# EAGLE design analogControlBoardV1 (EAGLE 6.4)
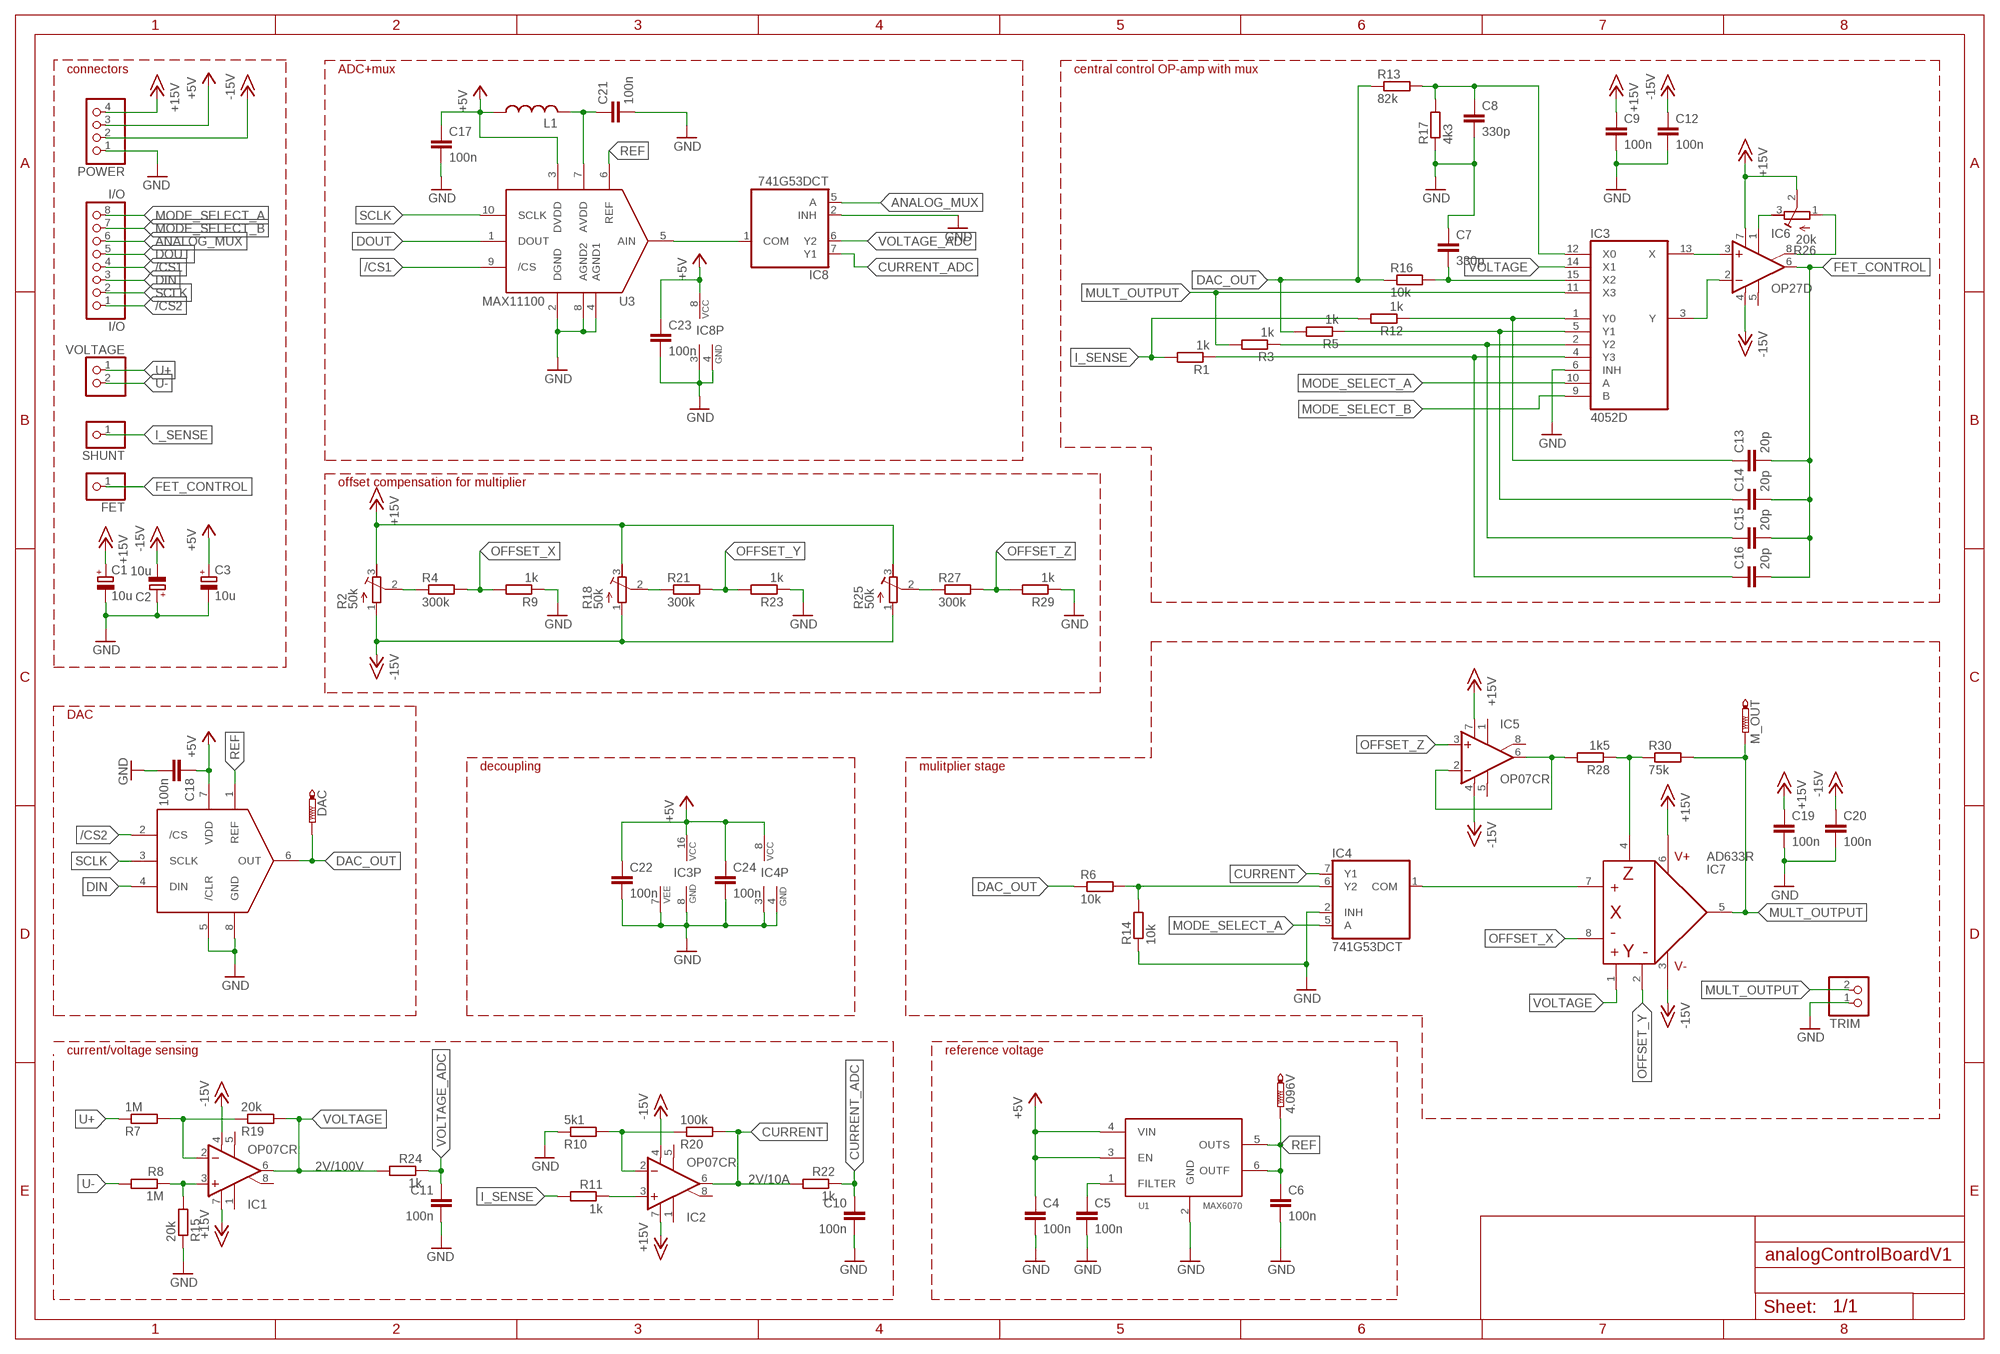
[diagram p0: schematic, sheet 1]

## Parts
4.096V  PTR1TP06R  [TP06R]
C1  10u  CPOL-EU153CLV-0505  [153CLV-0505]
C2  10u  CPOL-EU153CLV-0505  [153CLV-0505]
C3  10u  CPOL-EU153CLV-0505  [153CLV-0505]
C4  100n  C-EUC0603K  [C0603K]
C5  100n  C-EUC0603K  [C0603K]
C6  100n  C-EUC0603K  [C0603K]
C7  330p  C-EUC0603K  [C0603K]
C8  330p  C-EUC0603K  [C0603K]
C9  100n  C-EUC0603K  [C0603K]
C10  100n  C-EUC0603K  [C0603K]
C11  100n  C-EUC0603K  [C0603K]
C12  100n  C-EUC0603K  [C0603K]
C13  20p  C-EUC0603K  [C0603K]
C14  20p  C-EUC0603K  [C0603K]
C15  20p  C-EUC0603K  [C0603K]
C16  20p  C-EUC0603K  [C0603K]
C17  100n  C-EUC0603K  [C0603K]
C18  100n  C-EUC0603K  [C0603K]
C19  100n  C-EUC0603K  [C0603K]
C20  100n  C-EUC0603K  [C0603K]
C21  100n  C-EUC0603K  [C0603K]
C22  100n  C-EUC0603K  [C0603K]
C23  100n  C-EUC0603K  [C0603K]
C24  100n  C-EUC0603K  [C0603K]
DAC  PTR1TP06R  [TP06R]
FET  PINHD-1X1  [1X01]
I/O  I/O  PINHD-1X8  [1X08]
IC1  OP07CR  [SO08]
IC2  OP07CR  [SO08]
IC3  4052D  [SO16]
IC4  741G53DCT  [DCT_R-PDSO-G8]
IC5  OP07CR  [SO08]
IC6  OP27D  [SO08]
IC7  AD633R  [SO08]
IC8  741G53DCT  [DCT_R-PDSO-G8]
L1  INDUCTOR0603  [R0603]
M_OUT  PTR1TP06R  [TP06R]
POWER  PINHD-1X4  [1X04]
R1  1k  R-EU_R0603  [R0603]
R2  50k  R-TRIMM64W  [RTRIM64W]
R3  1k  R-EU_R0603  [R0603]
R4  300k  R-EU_R0603  [R0603]
R5  1k  R-EU_R0603  [R0603]
R6  10k  R-EU_R0603  [R0603]
R7  1M  R-EU_R0603  [R0603]
R8  1M  R-EU_R0603  [R0603]
R9  1k  R-EU_R0603  [R0603]
R10  5k1  R-EU_R0603  [R0603]
R11  1k  R-EU_R0603  [R0603]
R12  1k  R-EU_R0603  [R0603]
R13  82k  R-EU_R0603  [R0603]
R14  10k  R-EU_R0603  [R0603]
R15  20k  R-EU_R0603  [R0603]
R16  10k  R-EU_R0603  [R0603]
R17  4k3  R-EU_R0603  [R0603]
R18  50k  R-TRIMM64W  [RTRIM64W]
R19  20k  R-EU_R0603  [R0603]
R20  100k  R-EU_R0603  [R0603]
R21  300k  R-EU_R0603  [R0603]
R22  1k  R-EU_R0603  [R0603]
R23  1k  R-EU_R0603  [R0603]
R24  1k  R-EU_R0603  [R0603]
R25  50k  R-TRIMM64W  [RTRIM64W]
R26  20k  R-TRIMM64W  [RTRIM64W]
R27  300k  R-EU_R0603  [R0603]
R28  1k5  R-EU_R0603  [R0603]
R29  1k  R-EU_R0603  [R0603]
R30  75k  R-EU_R0603  [R0603]
SHUNT  PINHD-1X1  [1X01]
TRIM  PINHD-1X2  [1X02]
U1  MAX6070  [SOT23-6L]
U2  MAX5216  [UMAX8]
U3  MAX11100  [UMAX10]
VOLTAGE  PINHD-1X2  [1X02]

## Nets
+5V: C3.+ C4.1 C17.1 C18.1 C22.1 C23.1 C24.1 IC3.16(VCC) IC4.8(VCC) IC8.8(VCC) L1.1 POWER.3 U1.3(EN) U1.4(VIN) U2.7(VDD) U3.3(DVDD)
+15V: C1.+ C9.1 C19.1 IC1.7(V+) IC2.7(V+) IC5.7(V+) IC6.7(V+) IC7.6(V+) POWER.4 R2.3(A) R18.3(A) R25.3(A) R26.2(S)
-15V: C2.- C12.1 C20.1 IC1.4(V-) IC2.4(V-) IC5.4(V-) IC6.4(V-) IC7.3(V-) POWER.2 R2.1(E) R18.1(E) R25.1(E)
/CS1: I/O.4 U3.9(/CS)
/CS2: I/O.1 U2.2(/CS)
ANALOG_MUX: I/O.6 IC8.5(A)
CURRENT: IC2.6(OUT) IC4.7(Y1) R20.2 R22.2
CURRENT_ADC: C10.1 IC8.7(Y1) R22.1
DAC_OUT: DAC.TP R5.2 R6.1 R13.1 R16.1 U2.6(OUT)
DIN: I/O.3 U2.4(DIN)
DOUT: I/O.5 U3.1(DOUT)
FET_CONTROL: C13.2 C14.2 C15.2 C16.2 FET.1 IC6.6(OUT)
GND: C1.- C2.+ C3.- C4.2 C5.2 C6.2 C7.1 C8.2 C9.2 C10.2 C11.2 C12.2 C17.2 C18.2 C19.2 C20.2 C21.2 C22.2 C23.2 C24.2 IC3.6(INH) IC3.7(VEE) IC3.8(GND) IC4.2(INH) IC4.3(GND) IC4.4(GND) IC8.2(INH) IC8.3(GND) IC8.4(GND) POWER.1 R9.1 R10.1 R14.1 R15.1 R17.1 R23.1 R29.1 TRIM.1 U1.2(GND) U2.5(/CLR) U2.8(GND) U3.2(DGND) U3.4(AGND1) U3.8(AGND2)
I_SENSE: R1.2 R11.2 R12.2 SHUNT.1
MODE_SELECT_A: I/O.8 IC3.10(A) IC4.5(A)
MODE_SELECT_B: I/O.7 IC3.9(B)
MULT_OUTPUT: IC3.11(X3) IC7.5(OUT) M_OUT.TP R3.2 R30.2 TRIM.2
N$1: C8.1 IC3.12(X0) R13.2 R17.2
N$2: IC7.4(Z) R28.1 R30.1
N$3: IC4.6(Y2) R6.2 R14.2
N$4: C13.1 IC3.1(Y0) R12.1
N$5: IC2.3(+IN) R11.1
N$6: IC2.2(-IN) R10.2 R20.1
N$7: IC5.2(-IN) IC5.6(OUT) R28.2
N$8: R25.2(S) R27.1
N$10: C7.2 IC3.15(X2) R16.2
N$23: IC3.13(X) IC6.3(+IN)
N$25: C5.1 U1.1(FILTER)
N$32: IC3.3(Y) IC6.2(-IN)
N$33: IC4.1(COM) IC7.7(X+)
N$34: R18.2(S) R21.1
N$38: C16.1 IC3.4(Y3) R1.1
N$40: R2.2(S) R4.1
N$42: C15.1 IC3.2(Y2) R3.1
N$43: C14.1 IC3.5(Y1) R5.1
N$45: IC6.1(ON1) R26.3(A)
N$46: IC6.8(ON2) R26.1(E)
N$61: C21.1 L1.2 U3.7(AVDD)
N$65: IC8.1(COM) U3.5(AIN)
N$85: IC1.3(+IN) R8.1 R15.2
N$86: IC1.2(-IN) R7.2 R19.1
OFFSET_X: IC7.8(X-) R4.2 R9.2
OFFSET_Y: IC7.2(Y-) R21.2 R23.2
OFFSET_Z: IC5.3(+IN) R27.2 R29.2
REF: 4.096V.TP C6.1 U1.5(OUTS) U1.6(OUTF) U2.1(REF) U3.6(REF)
SCLK: I/O.2 U2.3(SCLK) U3.10(SCLK)
U+: R7.1 VOLTAGE.1
U-: R8.2 VOLTAGE.2
VOLTAGE: IC1.6(OUT) IC3.14(X1) IC7.1(Y+) R19.2 R24.2
VOLTAGE_ADC: C11.1 IC8.6(Y2) R24.1
Unconnected: IC1.1(ON1) IC1.5(OPT) IC1.8(ON2) IC2.1(ON1) IC2.5(OPT) IC2.8(ON2) IC5.1(ON1) IC5.5(OPT) IC5.8(ON2) IC6.5(OPT)

## Notes on the sheet
- connectors | ADC+mux | central control OP-amp with mux
- offset compensation for multiplier
- DAC
- decoupling | mulitplier stage
- current/voltage sensing | reference voltage
- 2V/100V
- 2V/10A

## Library data of the parts
4.096V DAC M_OUT = testpad:PTR1: TEST PIN
C1-C3 = rcl:CPOL-EU: POLARIZED CAPACITOR, European symbol
C4-C24 = rcl:C-EU: CAPACITOR, European symbol
FET SHUNT = pinhead:PINHD-1X1: PIN HEADER
I/O = pinhead:PINHD-1X8: PIN HEADER
IC1 IC2 IC5 = linear:OP07*: OP AMP
IC3 = 40xx:4052: Dual 4-channel ANALOG MULTIPLEXER
IC4 IC8 = 74xx-little-us:74*1G53: SINGLE-POLE DOUBLE-THROW (SPDT) ANALOG SWITCH 2:1 ANALOG MULTIPLEXER/DEMULTIPLEXER Source: http://focus.ti.com/lit/ds/symlink/sn74lvc2g53.pdf
IC6 = linear:OP27: OP AMP
IC7 = synthdiy:AD633: AD633 Multiplier (X*Y)/(10*Z)
L1 = xmaker:INDUCTOR: Inductor
POWER = pinhead:PINHD-1X4: PIN HEADER
R1 R3-R17 R19-R24 R27-R30 = resistor:R-EU_: RESISTOR, European symbol
R2 R18 R25 R26 = resistor:R-TRIMM: Trimm resistor
TRIM VOLTAGE = pinhead:PINHD-1X2: PIN HEADER
U1 = maxim:MAX6070
U2 = maxim:MAX5216
U3 = maxim:MAX11100

## Board
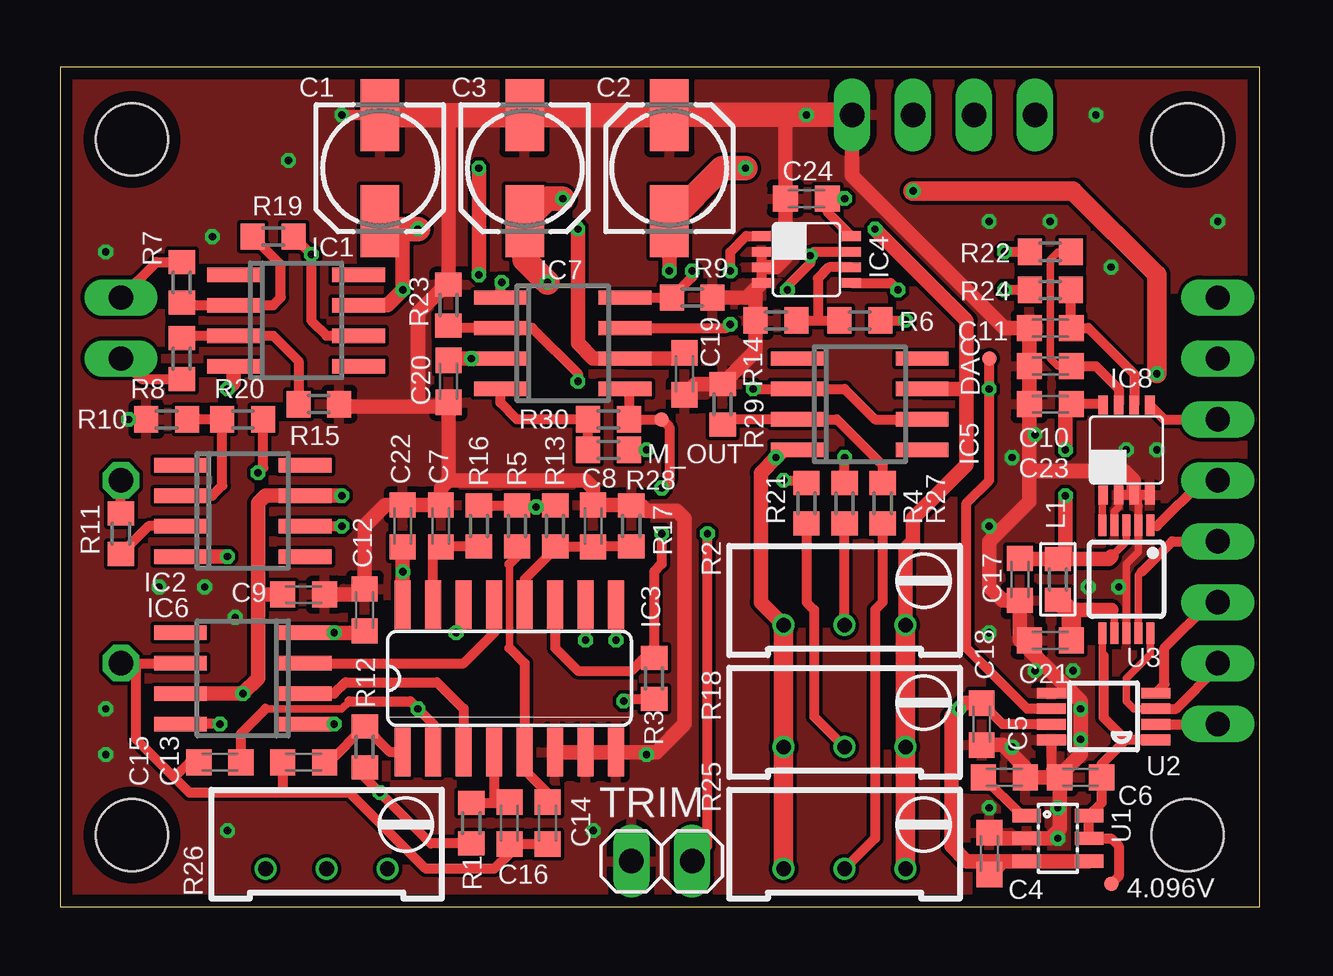
[diagram p1: board, top side]
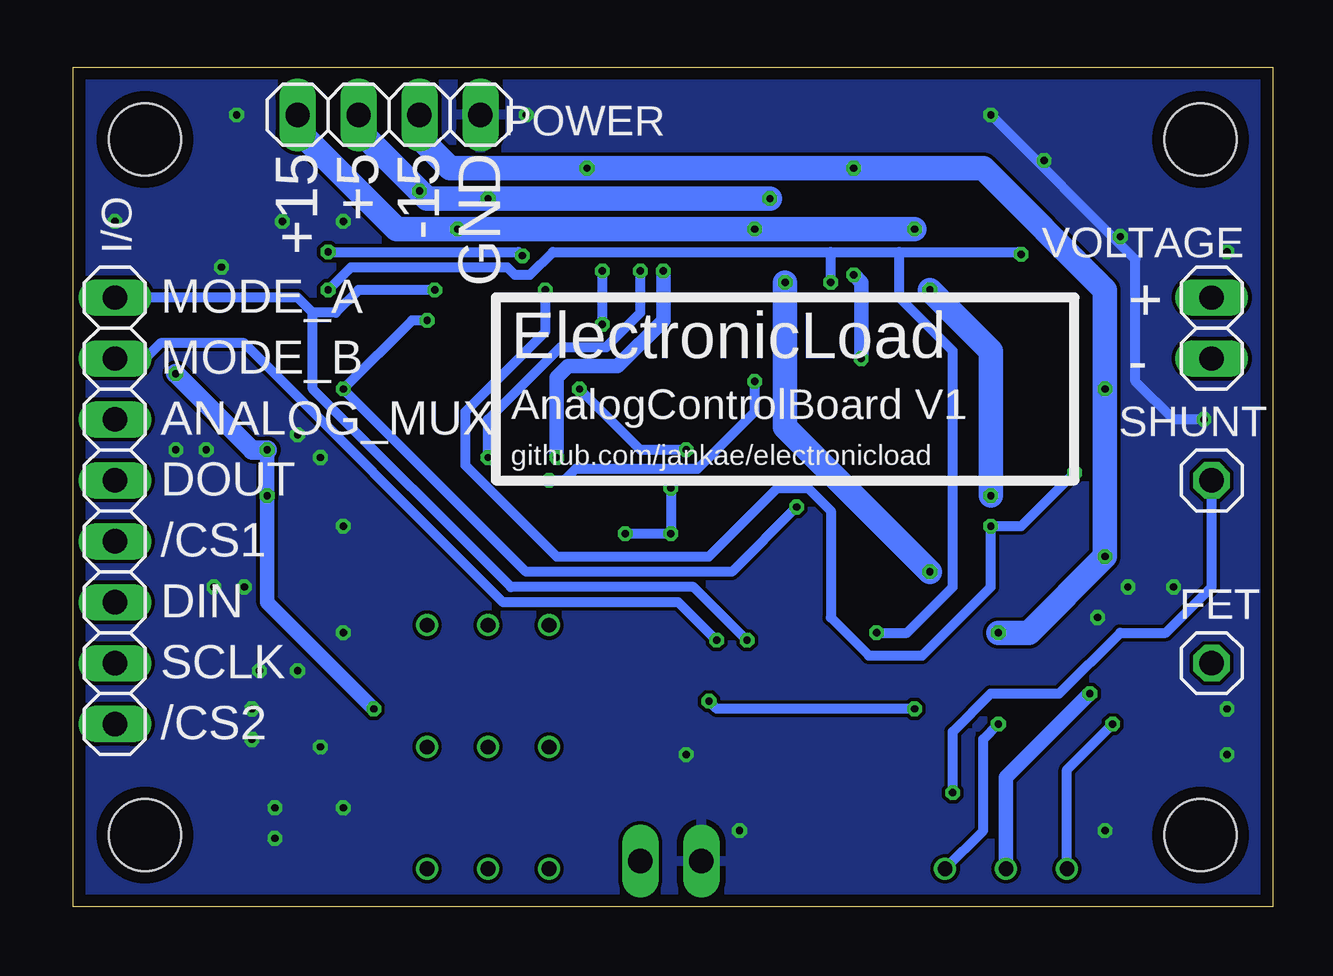
[diagram p2: board, bottom side, seen from below]

Size 50 x 35 mm. Coordinates in mm from the lower left corner, seen from the top.
Outline: 0,0 50,0 50,35 0,35 0,0
Copper layers (1*16): Top 0.035mm / dielectric 1.6mm / Bottom 0.035mm
Design rules "Elecrow_2-layer_PCB_eagle_rule": minimum track width 6mil, minimum drill 12mil, track to track 6mil, track to pad 6mil, pad to pad 6mil, via to via 8mil, smd to smd 0mil, copper to edge 20mil, drill to drill 10mil, minimum pad ring 6mil, minimum via ring 6mil, stop-mask expansion 0mil, vias tented up to drill 100mil, thermal gap 10mil
Holes 3 mm at 3,32 3,3 47,3 47,32

### Footprints (pad centres in the part's own frame; a part is rotated, then mirrored left to right if it is on the bottom)
TP06R = smd 0.6 x 0.6: TP 0,0
153CLV-0505 = smd 3 x 1.6: + 2.2,0; - -2.2,0
C0603K = smd 1.05 x 1.08: 1 -0.875,0; 2 0.875,0
1X01 = drill 1.016 octagon: 1 0,0
1X08 = drill 1.016 long: 1 -8.89,0; 2 -6.35,0; 3 -3.81,0; 4 -1.27,0; 5 1.27,0; 6 3.81,0; 7 6.35,0; 8 8.89,0
SO08 = smd 0.6 x 2.2: 1 -1.905,-2.6; 2 -0.635,-2.6; 3 0.635,-2.6; 4 1.905,-2.6; 5 1.905,2.6; 6 0.635,2.6; 7 -0.635,2.6; 8 -1.905,2.6
SO16 = smd 0.66 x 2.032: 1 -4.445,-3.073; 2 -3.175,-3.073; 3 -1.905,-3.073; 4 -0.635,-3.073; 5 0.635,-3.073; 6 1.905,-3.073; 7 3.175,-3.073; 8 4.445,-3.073; 9 4.445,3.073; 10 3.175,3.073; 11 1.905,3.073; 12 0.635,3.073; 13 -0.635,3.073; 14 -1.905,3.073; 15 -3.175,3.073; 16 -4.445,3.073
DCT_R-PDSO-G8 = smd 0.4 x 0.8: 1 -0.975,-1.875; 2 -0.325,-1.875; 3 0.325,-1.875; 4 0.975,-1.875; 5 0.975,1.875; 6 0.325,1.875; 7 -0.325,1.875; 8 -0.975,1.875
R0603 = smd 1.1 x 1: 1 0,-0.85; 2 0,0.85
1X04 = drill 1.016 long: 1 -3.81,0; 2 -1.27,0; 3 1.27,0; 4 3.81,0
R0603' = smd 1 x 1.1: 1 -0.85,0; 2 0.85,0
RTRIM64W = drill 0.61: 1 1.27,-2.54; 2 1.27,0; 3 1.27,2.54
1X02 = drill 1.016 long: 1 -1.27,0; 2 1.27,0
SOT23-6L = smd 0.55 x 1.2: 1 -0.95,-1.3; 2 0,-1.3; 3 0.95,-1.3; 4 0.95,1.3; 5 0,1.3; 6 -0.95,1.3
UMAX8 = smd 0.45 x 1.2: 1 -0.975,-2.175; 2 -0.325,-2.175; 3 0.325,-2.175; 4 0.975,-2.175; 5 0.975,2.175; 6 0.325,2.175; 7 -0.325,2.175; 8 -0.975,2.175
UMAX10 = smd 0.32 x 0.9: 1 -1,-2.25; 2 -0.5,-2.25; 3 0,-2.25; 4 0.5,-2.25; 5 1,-2.25; 6 1,2.25; 7 0.5,2.25; 8 0,2.25; 9 -0.5,2.25; 10 -1,2.25

### Placement (x,y rotation side)
4.096V  43.81,0.95 0 top
C1  13.34,30.8 270 top
C2  25.4,30.8 90 top
C3  19.37,30.8 270 top
C4  38.73,2.22 90 top
C5  39.37,5.4 0 top
C6  42.55,5.4 180 top
C7  15.88,15.88 270 top
C8  22.23,15.88 90 top
C9  10.16,13.02 0 top
C10  41.27,22.54 180 top
C11  41.27,24.13 180 top
C12  12.7,12.38 90 top
C13  10.16,6.03 180 top
C14  20.32,3.49 270 top
C15  6.67,6.03 180 top
C16  18.73,3.49 270 top
C17  40.01,13.65 270 top
C18  38.42,7.62 270 top
C19  26.04,22.23 270 top
C20  16.19,21.91 270 top
C21  41.27,11.11 180 top
C22  14.29,15.88 90 top
C23  41.27,20.95 180 top
C24  31.11,29.53 180 top
DAC  38.73,22.86 0 top
FET  2.54,10.16 0 bottom
I/O  48.26,16.51 90 bottom
IC1  9.84,24.45 270 top
IC2  7.62,16.51 270 top
IC3  18.73,9.53 0 top
IC4  31.11,26.99 270 top
IC5  33.34,20.95 270 top
IC6  7.62,9.53 90 top
IC7  20.95,23.5 270 top
IC8  44.45,19.05 0 top
L1  41.59,13.65 180 top
M_OUT  25.08,20.32 0 top
POWER  36.83,33.02 180 bottom
R1  1k  [R0603']  17.14,3.49 270 top
R2  32.7,13.02 270 top
R3  1k  [R0603']  24.77,9.53 90 top
R4  300k  [R0603']  32.7,16.83 90 top
R5  1k  [R0603']  19.05,15.88 90 top
R6  10k  [R0603']  33.34,24.45 180 top
R7  1M  [R0603']  5.08,26.04 270 top
R8  1M  [R0603']  5.08,22.86 270 top
R9  1k  [R0603']  26.35,25.4 180 top
R10  5k1  [R0603']  4.45,20.32 0 top
R11  1k  [R0603']  2.54,15.56 90 top
R12  1k  [R0603']  12.7,6.67 270 top
R13  82k  [R0603']  20.64,15.88 270 top
R14  10k  [R0603']  29.84,24.45 0 top
R15  20k  [R0603']  10.79,20.95 180 top
R16  10k  [R0603']  17.46,15.88 270 top
R17  4k3  [R0603']  23.81,15.88 270 top
R18  32.7,7.94 270 top
R19  20k  [R0603']  8.89,27.94 0 top
R20  100k  [R0603']  7.62,20.32 0 top
R21  300k  [R0603']  31.11,16.83 90 top
R22  1k  [R0603']  41.27,27.3 180 top
R23  1k  [R0603']  16.19,25.08 270 top
R24  1k  [R0603']  41.27,25.72 180 top
R25  32.7,2.86 270 top
R26  11.11,2.86 270 top
R27  300k  [R0603']  34.29,16.83 90 top
R28  1k5  [R0603']  22.86,19.05 0 top
R29  1k  [R0603']  27.62,20.95 270 top
R30  75k  [R0603']  22.86,20.32 0 top
SHUNT  2.54,17.78 0 bottom
TRIM  25.08,1.91 0 top
U1  41.59,2.86 270 top
U2  43.5,7.94 90 top
U3  44.45,13.65 180 top
VOLTAGE  2.54,24.13 270 bottom

### Tracks (layer width: path | path; a pad name or v marks a point on that pad's centre or on a via)
+5V  (via drill 0.3)
  Top 0.305: 43.81,14.61 44.45,15.24 U3.3
  Top 0.406: C24.1 31.99,28.96 IC4.8 32.07,28.89 32.07,29.53 v32.7,29.53 | U2.7 39.3,7.61 C18.1 | C23.1 42.23,20.95 43.45,20.95 IC8.8
  Top 0.61: IC3.16 v14.29,13.97 C22.1 | C4.1 39.3,1.91 | 39.3,1.91 U1.3 U1.4 | 39.3,1.91 37.78,1.91 37.15,2.54 37.15,7.94 v37.47,8.26 37.7,8.49 C18.1 | C17.1 40.03,14.5 L1.1 | L1.1 43.71,14.5 43.81,14.61 | 42.23,20.95 41.91,20.64 v41.91,19.05 | v41.91,17.14 41.91,14.82 L1.1
  Top 0.813: v35.56,29.84 42.23,29.84 45.72,26.35 v45.72,22.23
  Top 1.016: v20.95,29.53 20.3,29.53 C3.+ 19.37,26.99 v20.32,26.04
  Bottom 0.61: v41.91,19.05 v41.91,17.14 41.91,12.7 v37.47,8.26
  Bottom 0.813: v45.72,22.23 42.55,19.05 v41.91,19.05
  Bottom 1.016: POWER.3 38.1,32.38 v35.56,29.84 35.24,29.53 v32.7,29.53 v20.95,29.53 | v14.29,13.97 20.32,20 v20.32,26.04
+15V  (via drill 0.3)
  Top 0.61: IC1.7 13.65,25.08 v14.29,25.72 14.29,27.64 C1.+ | IC6.7 v7.62,8.89 8.26,9.53 8.26,13.02 | R2.3 35.24,14.92 35.56,15.24 35.56,16.19 37.78,18.41 37.78,21.59 | 37.78,21.59 37.78,24.45 v33.97,28.26 | IC5.7 37.78,21.59 | C19.1 25.8,22.86 IC7.6 22.23,22.86 21.59,23.5 v21.59,28.26 | 8.26,13.02 8.26,16.83 8.57,17.14 IC2.7 v11.75,17.14 | C9.1 8.26,13.02
  Top 0.813: R25.3 R18.3 R2.3
  Top 1.016: v14.92,28.26 13.68,28.26 C1.+
  Bottom 0.61: R26.2 11.11,5.4 v7.62,8.89
  Bottom 1.016: POWER.4 40.64,32.38 36.51,28.26 v33.97,28.26 v21.59,28.26 v14.92,28.26 | v11.75,17.14 11.75,23.18 v14.29,25.72
-15V  (via drill 0.3)
  Top 0.61: C12.1 12.62,11.43 v11.43,11.43 IC6.4 | IC7.3 v17.14,22.86 16.27,22.86 C20.1 | 29.84,12.06 R2.1 29.21,12.7 29.21,18.1 v29.84,18.73 30.16,19.05 IC5.4 | v6.99,14.61 IC2.4 | IC1.4 7.24,21.85 v6.99,21.59 | v17.46,26.35 v17.46,30.8 | v25.4,26.51 C2.-
  Top 0.813: R25.1 R18.1 R2.1
  Top 1.016: v28.57,30.8 27.6,30.8 C2.-
  Bottom 0.61: v17.14,22.86 17.14,26.04 v17.46,26.35 | v29.84,18.73 29.84,22.07 29.37,22.54 27.3,22.54 25.4,24.45 v25.4,26.51
  Bottom 1.016: POWER.2 35.56,32.07 34.29,30.8 v28.57,30.8 v17.46,30.8 12.06,30.8 6.99,25.72 v6.99,21.59 v6.99,14.61 10.16,11.43 v11.43,11.43
/CS1
  Top 0.305: U3.9 44.95,13.84 45.09,13.97
  Top 0.406: 45.09,13.97 46.35,15.24 I/O.4
/CS2
  Top 0.406: U2.2 I/O.1
ANALOG_MUX
  Top 0.406: IC8.5 46.03,20.32 I/O.6
CURRENT  (via drill 0.3)
  Top 0.406: IC2.6 v11.75,15.88 | v8.26,18.1 8.47,18.31 R20.2 | R22.2 v39.37,27.3 | IC4.7 31.44,27.31 v31.27,27.15 31.27,26.83 30.32,25.88 v30.32,25.72
  Bottom 0.406: v8.26,18.1 10.48,15.88 v11.75,15.88 11.75,13.34 14.61,10.48 16.83,10.48 18.41,12.06 18.41,16.51 19.37,17.46 20.64,17.46 23.5,14.61 29.84,14.61 33.66,18.41 33.66,20.64 30.32,23.97 v30.32,25.72 | v39.37,27.3 31.43,27.3 v31.27,27.15
CURRENT_ADC
  Top 0.305: C10.1 41.59,22.54 41.27,22.86 41.27,26.99 41.59,27.3 R22.1
  Top 0.406: C10.1 43.18,22.54 44.13,21.59 44.13,20.93 IC8.7
DAC_OUT  (via drill 0.3)
  Top 0.406: R16.1 R5.2 R13.1 19.9,16.73 v19.84,16.67 | U2.6 40.31,8.26 37.78,10.79 37.78,16.83 38.73,17.78 v38.73,21.59 DAC.TP | R6.1 v35.24,24.45
  Bottom 0.406: v35.24,24.45 35.88,24.45 v38.73,21.59 31.11,13.97 22.54,13.97 v19.84,16.67
DIN
  Top 0.406: U2.4 46.04,9.28 46.04,10.79 47.94,12.7 I/O.3
DOUT
  Top 0.305: U3.1 45.48,15.88 45.72,15.88
  Top 0.406: 45.72,15.88 47.62,17.78 I/O.5
FET_CONTROL
  Top 0.406: FET.1 3.17,10.16 | 3.17,10.16 IC6.6 | C14.2 C16.2 18.73,2.22 18.1,1.59 15.24,1.59 12.06,4.76 9.21,4.76 | 9.21,4.76 5.4,4.76 4.76,5.4 | 4.76,5.4 3.17,6.99 3.17,10.16 | C13.2 9.29,4.84 9.21,4.76 | C15.2 5.4,6.03 4.76,5.4
GND  (via drill 0.3)
  Top 0.305: U3.8 44.45,14.29 44.95,14.79 U3.2 44.95,17 IC8.3 | U3.4 43.95,16.49 44.13,16.67 44.12,16.68 IC8.2
  Top 0.406: IC4.2 IC4.3 IC4.4 | U2.8 41.32,5.75 C6.2 | IC8.4 IC8.3 IC8.2 | U2.5 41.34,8.89 42.23,8.89 | R10.1 v2.86,20.32 | v11.75,33.02 13.31,33.02 C1.-
  Top 0.61: C19.2 26.49,21.8 R29.1 29,23.18 R14.1 29,25.77 IC4.4 28.63,25.4 R9.1 | 29.84,33.02 30.24,32.62 C24.2 30.24,27.07 29.84,26.67 IC4.3 | C4.2 38.98,2.86 U1.2 41.27,2.86 41.67,3.25 C6.2 | C6.2 C5.2 40.24,5.79 39.29,6.75 C18.2 | C6.2 41.67,5.47 42.55,6.35 42.55,8.57 42.23,8.89 40.4,10.72 C21.2 40.01,11.11 C17.2 39.29,12.78 38.73,13.34 38.73,15.24 40.4,16.91 40.4,18.25 | IC8.3 44.77,17.18 44.77,17.78 44.37,18.18 40.48,18.18 40.4,18.25 | 40.4,18.25 C23.2 C10.2 C11.2 39.37,24.13 33.02,30.48 POWER.1 | 16.19,33 R23.1 16.09,25.93 14.92,24.77 14.92,20.85 | R15.1 11.75,20.85 14.92,20.85 | 16.19,17.78 21.91,17.78 22.23,17.46 C8.2 23.79,16.75 R17.1 24.23,16.73 24.45,16.51 25.72,16.51 26.04,16.19 26.04,7.62 24.87,6.45 IC3.8 IC3.7 IC3.6 | 16.19,17.78 15.88,17.46 C7.1 C22.2 13.57,16.75 12.7,15.88 C12.2 12.46,13.02 C9.2 | 16.19,17.78 C20.2 16.01,20.85 14.92,20.85
  Top 1.016: POWER.1 29.84,33.02 26.04,33.02 | 26.04,33.02 25.42,33.02 C2.+ | C1.- 16.19,33 C3.- 26.01,33 26.04,33.02
  Bottom 0.406: v2.86,20.32 4.13,20.32 5.71,21.91 5.71,26.99 v11.75,33.02
  other vias: 31.11,33.02 43.18,33.02 48.26,28.57 38.73,28.57 41.27,28.57 43.81,26.67 40.64,19.68 39.69,18.73 38.73,15.88 38.73,11.43 40.64,9.84 42.23,9.84 42.86,13.34 44.13,13.34 44.45,19.05 45.72,19.05 42.55,6.99 42.55,8.26 39.69,6.67 38.73,4.13 41.59,2.86 41.59,4.13 24.45,6.35 22.23,3.17 7.3,12.06 6.03,13.34 4.13,13.34 1.91,8.26 1.91,6.35 6.99,3.17 6.35,27.94 1.91,27.3 9.53,31.11
  pour Top: -1.27,36.2 50.48,36.2 50.48,-0.64 -1.27,-0.64
  pour Bottom: -0.64,35.56 51.12,35.56 51.12,-1.59 -0.64,-1.59 -0.64,35.24
I_SENSE  (via drill 0.3)
  Top 0.406: R11.2 SHUNT.1 | R1.2 15.46,2.64 v13.34,4.76 12.7,5.4 R12.2
  Bottom 0.406: v13.34,4.76 13.34,7.3 11.75,8.89 8.89,8.89 6.35,11.43 4.45,11.43 2.54,13.34 SHUNT.1
MODE_SELECT_A  (via drill 0.3)
  Top 0.406: IC3.10 v21.91,11.11 | IC4.5 34.63,26.01 v34.92,25.72
  Bottom 0.406: 40.01,24.77 40.01,21.59 31.75,13.34 24.13,13.34 v21.91,11.11 | 40.01,24.77 40.64,25.4 I/O.8 | v34.92,25.72 38.1,25.72 39.05,24.77 40.01,24.77
MODE_SELECT_B  (via drill 0.3)
  Top 0.406: IC3.9 v23.18,11.11
  Bottom 0.406: v23.18,11.11 24.77,12.7 32.07,12.7 42.86,23.5 46.35,23.5 46.99,22.86 I/O.7
MULT_OUTPUT  (via drill 0.3)
  Top 0.406: IC3.11 20.64,10.79 21.59,9.84 23.81,9.84 24.34,10.38 R3.2 24.77,13.97 25.08,14.29 v25.08,15.56 | IC7.5 23.71,21.43 R30.2 M_OUT.TP 25.4,20 25.4,17.78 v25.08,17.46 | TRIM.2 26.99,2.54 v26.99,15.56
  Bottom 0.406: v25.08,17.46 v25.08,15.56 v26.99,15.56
N$1
  Top 0.406: R17.2 22.25,15.03 C8.1 20.66,15 R13.2 20.64,14.92 19.37,13.65 IC3.12
N$2
  Top 0.406: R28.1 R30.1 19.05,20.32 18.36,21.02 IC7.4
N$3
  Top 0.406: R14.2 31.59,24.45 | 31.59,24.45 R6.2 | IC4.6 32.06,26.66 31.59,26.19 31.59,24.45
N$4
  Top 0.406: C13.1 11.21,6.03 R12.1 13.77,6.45 IC3.1
N$5
  Top 0.406: IC2.3 3.71,15.88 R11.1
N$6
  Top 0.406: IC2.2 6.35,17.14 6.77,17.57 R20.1 R10.2
N$7  (via drill 0.3)
  Top 0.406: IC5.6 33.97,20.32 32.7,21.59 IC5.2 v28.89,21.59 | R28.2 v24.45,19.05
  Bottom 0.406: v24.45,19.05 26.35,19.05 v28.89,21.59
N$8
  Top 0.406: R27.1 34.29,12.7 33.97,12.38 33.97,2.86 R25.2
N$10
  Top 0.406: IC3.15 15.56,14.68 C7.2 15.9,15.03 R16.2
N$23
  Top 0.406: IC6.3 16.83,10.16 18.1,11.43 IC3.13
N$25
  Top 0.406: U1.1 40.09,3.81 C5.1
N$32
  Top 0.406: IC3.3 16.83,8.26 15.72,9.37 11.91,9.37 11.43,8.89 IC6.2
N$33  (via drill 0.3)
  Top 0.406: v27.94,26.51 27.94,27.3 28.6,27.96 IC4.1 | IC7.7 27.78,24.13 v27.94,24.29
  Bottom 0.406: v27.94,24.29 v27.94,26.51
N$34
  Top 0.406: R21.1 31.11,12.7 31.43,12.38 31.43,7.94 R18.2
N$38
  Top 0.406: R1.1 18.1,4.34 | 18.1,4.34 18.71,4.34 C16.1 | IC3.4 18.1,4.34
N$40
  Top 0.406: R2.2 R4.1
N$42  (via drill 0.3)
  Top 0.305: 8.57,8.26 11.75,8.26 12.06,8.57
  Top 0.406: C15.1 7.54,7.22 8.57,8.26 | 12.06,8.57 14.61,8.57 v14.92,8.26 15.56,7.62 IC3.2 | v23.5,8.57 23.6,8.68 R3.1
  Bottom 0.406: v14.92,8.26 23.18,8.26 v23.5,8.57
N$43
  Top 0.305: 18.73,14.29 18.73,10.79
  Top 0.406: C14.1 20.32,4.76 19.37,5.71 IC3.5 19.37,10.16 18.73,10.79 | R5.1 19.05,14.61 18.73,14.29
N$45  (via drill 0.3)
  Top 0.406: v11.43,7.62 IC6.1
  Bottom 0.406: R26.3 12.06,3.17 12.06,6.99 v11.43,7.62
N$46  (via drill 0.3)
  Top 0.406: v6.67,7.62 IC6.8
  Bottom 0.406: R26.1 8.57,5.71 v6.67,7.62
N$61
  Top 0.305: U3.7 43.95,12.25 43.81,12.38
  Top 0.61: 43.81,12.38 42.01,12.38 41.96,12.43
  Top 0.813: L1.2 41.96,12.43 42.15,12.24 C21.1
N$65
  Top 0.305: U3.5 43.45,17.15 IC8.1
N$85
  Top 0.406: R8.1 5.18,23.81 IC1.3 8.89,23.81 9.95,22.76 R15.2
N$86
  Top 0.406: R7.2 5.18,25.08 IC1.2 8.89,25.08 9.21,25.4 9.21,26.77 R19.1
OFFSET_X  (via drill 0.3)
  Top 0.406: IC7.8 R9.2 26.35,26.25 v26.35,26.51 | R4.2 v32.7,18.73
  Bottom 0.406: v32.7,18.73 32.7,20.32 29.69,23.34 27.78,23.34 26.35,24.77 v26.35,26.51
OFFSET_Y  (via drill 0.3)
  Top 0.406: R23.2 16.3,24.13 IC7.2 19.68,24.13 21.59,22.23 v21.59,21.91 | v30.16,17.78 31.01,17.78 R21.2
  Bottom 0.406: v21.59,21.91 21.59,20.64 23.97,18.26 29.05,18.26 29.53,17.78 v30.16,17.78
OFFSET_Z
  Top 0.406: R29.2 27.84,20.32 IC5.3 32.38,20.32 34.29,18.41 R27.2
REF
  Top 0.305: U3.6 43.45,10.53 43.5,10.48
  Top 0.406: U2.1 44.43,6.96 | 44.43,6.96 43.42,5.96 C6.1 43.42,4.33 U1.6 U1.5 43.81,2.86 44.13,2.54 44.13,1.27 4.096V.TP | 43.5,10.48 43.5,7.89 44.43,6.96
SCLK
  Top 0.305: U3.10 45.45,10.53 44.45,9.53 44.45,8.57 44.77,8.26 U2.3
  Top 0.406: U2.3 46.52,8.26 48.26,10 I/O.2
U+
  Top 0.406: VOLTAGE.1 4.03,26.89 R7.1
U-
  Top 0.406: VOLTAGE.2 3.39,22.01 R8.2
VOLTAGE  (via drill 0.3)
  Top 0.406: R19.2 v10.48,27.2 10.48,24.45 11.11,23.81 IC1.6 | R24.2 v39.37,25.72 | IC7.1 18.36,25.98 v18.41,26.04 | IC3.14 16.83,11.75 v16.51,11.43
  Bottom 0.406: v39.37,25.72 38.42,26.67 31.91,26.67 31.59,26.35 30.96,26.35 30,27.3 18.41,27.3 | 18.41,27.3 15.56,27.3 | 15.56,27.3 10.58,27.3 v10.48,27.2 | v18.41,26.04 18.41,27.3 | v16.51,11.43 15.24,11.43 13.34,13.34 13.34,23.18 15.56,25.4 15.56,27.3
VOLTAGE_ADC
  Top 0.406: IC8.6 44.77,22.22 42.86,24.13 C11.1 42.12,24.16 R24.1

### Text on the board
bPlace: GND | -15 | +5 | +15 | MODE_A | + | ElectronicLoad | - | MODE_B | AnalogControlBoard V1 | ANALOG_MUX | github.com/jankae/electronicload | DOUT | /CS1 | DIN | SCLK | /CS2